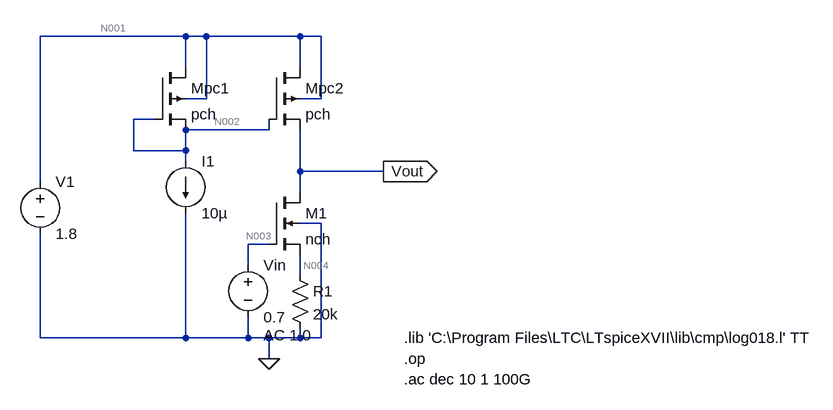
[diagram p0: schematic Exc2.asc]
Exc2.asc, the LTspice schematic file:
Version 4
SHEET 1 1112 680
WIRE 64 -32 -160 -32
WIRE 96 -32 64 -32
WIRE 240 -32 96 -32
WIRE 272 -32 240 -32
WIRE 64 16 64 -32
WIRE 240 16 240 -32
WIRE 96 64 96 -32
WIRE 96 64 64 64
WIRE 272 64 272 -32
WIRE 272 64 240 64
WIRE 16 96 -16 96
WIRE 192 112 192 96
WIRE 192 112 64 112
WIRE -16 144 -16 96
WIRE 64 144 64 112
WIRE 64 144 -16 144
WIRE 64 160 64 144
WIRE 240 176 240 112
WIRE 368 176 240 176
WIRE -160 192 -160 -32
WIRE 240 208 240 176
WIRE 272 256 240 256
WIRE 192 288 160 288
WIRE 160 320 160 288
WIRE 240 336 240 304
WIRE -160 432 -160 272
WIRE 64 432 64 240
WIRE 64 432 -160 432
WIRE 160 432 160 400
WIRE 160 432 64 432
WIRE 192 432 160 432
WIRE 240 432 240 416
WIRE 240 432 192 432
WIRE 272 432 272 256
WIRE 272 432 240 432
WIRE 192 464 192 432
FLAG 192 464 0
FLAG 368 176 Vout
IOPIN 368 176 Out
SYMBOL nmos4 192 208 R0
SYMATTR InstName M1
SYMATTR Value nch
SYMATTR Value2 l=0.18u w=1u m=8
SYMBOL pmos4 192 16 R0
SYMATTR InstName Mpc2
SYMATTR Value pch
SYMATTR Value2 l=1u w=1u
SYMBOL pmos4 16 16 R0
SYMATTR InstName Mpc1
SYMATTR Value pch
SYMATTR Value2 l=1u w=1u
SYMBOL current 64 160 R0
WINDOW 123 0 0 Left 0
WINDOW 39 0 0 Left 0
SYMATTR InstName I1
SYMATTR Value 10µ
SYMBOL voltage 160 304 R0
WINDOW 123 24 124 Left 2
WINDOW 39 0 0 Left 0
SYMATTR Value2 AC 1 0
SYMATTR InstName Vin
SYMATTR Value 0.7
SYMBOL voltage -160 176 R0
WINDOW 123 0 0 Left 0
WINDOW 39 0 0 Left 0
SYMATTR InstName V1
SYMATTR Value 1.8
SYMBOL res 224 320 R0
SYMATTR InstName R1
SYMATTR Value 20k
TEXT 400 464 Left 2 !.op
TEXT 400 432 Left 2 !.lib 'C:\\Program Files\\LTC\\LTspiceXVII\\lib\\cmp\\log018.l' TT
TEXT 400 496 Left 2 !.ac dec 10 1 100G

The netlist it stands for:
* Exc2.asc
M1 Vout N003 N004 0 nch l=0.18u w=1u m=8
Mpc2 N001 N002 Vout N001 pch l=1u w=1u
Mpc1 N001 N002 N002 N001 pch l=1u w=1u
I1 N002 0 10µ
Vin N003 0 0.7 AC 1 0
V1 N001 0 1.8
R1 N004 0 20k
.model NMOS NMOS
.model PMOS PMOS
.lib standard.mos
.op
.lib 'C:\Program Files\LTC\LTspiceXVII\lib\cmp\log018.l' TT
.ac dec 10 1 100G
.backanno
.end

* Results of the author's LTspice run, read from the files saved beside the schematic
* Operating Point, zero values left out:
*   V(vout) = 985.1 mV
*   V(n003) = 700 mV
*   V(n004) = 198 mV
*   V(n001) = 1.8 V
*   V(n002) = 697.2 mV
*   Id(Mpc1) = 10 µA
*   Ib(Mpc1) = 1.113 pA
*   Is(Mpc1) = -10 µA
*   Id(Mpc2) = 9.899 µA
*   Is(Mpc2) = -9.899 µA
*   Id(M1) = 9.899 µA
*   Ib(M1) = -10.1 pA
*   Is(M1) = -9.899 µA
*   I(I1) = 10 µA
*   I(R1) = 9.899 µA
*   I(V1) = -19.9 µA
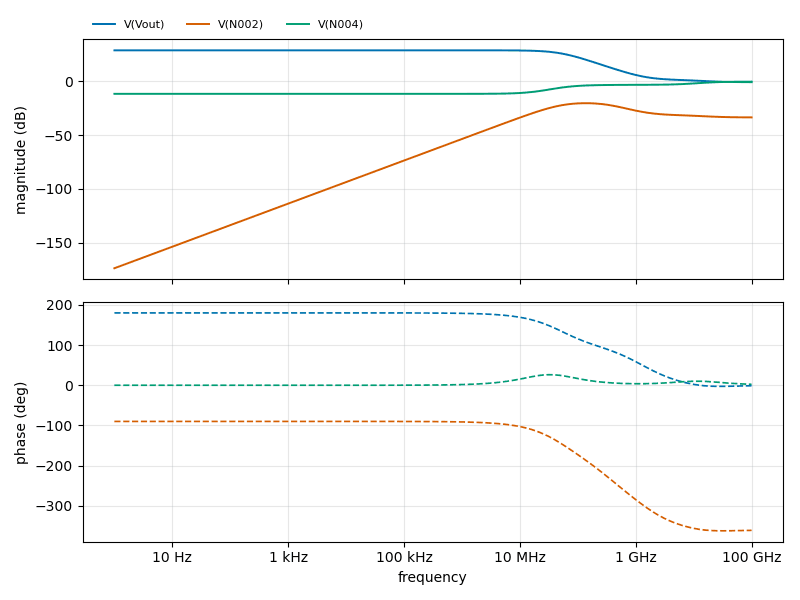
[diagram p1: AC Analysis of Exc2.asc, plotted from the saved traces]
* AC Analysis, 1 run:
*   V(Vout): 28.61 dB at 1 Hz, -0.93 dB at 100 GHz, peak 28.61 dB at 1 Hz, 3 dB below the peak at 53.04 MHz
*   V(N002): -173.70 dB at 1 Hz, -33.64 dB at 100 GHz, peak -20.46 dB at 125.9 MHz, 3 dB below the peak at 41.72 MHz and 467.5 MHz
*   V(N004): -11.77 dB at 1 Hz, -0.45 dB at 100 GHz, peak -0.45 dB at 100 GHz, 3 dB below the peak at 620.4 MHz
* From the log:
*   Semiconductor Device Operating Points:
*                           --- BSIM3 MOSFETS ---
*   Name:       mpc1        mpc2         m1
*   Model:      pch.8       pch.8       nch.9
*   Id:        1.00e-05    9.90e-06    9.90e-06
*   Vgs:       0.00e+00   -2.88e-01    5.02e-01
*   Vds:       1.10e+00    8.15e-01    7.87e-01
*   Vbs:       1.10e+00    8.15e-01   -1.98e-01
*   Vth:      -4.49e-01   -4.49e-01    5.80e-01
*   Vdsat:    -5.32e-01   -5.32e-01    5.17e-02
*   Gm:        2.69e-05    2.65e-05    2.06e-04
*   Gds:       2.74e-07    4.79e-07    4.63e-06
*   Gmb        9.38e-06    9.26e-06    5.33e-05
*   Cbd:       0.00e+00    0.00e+00    0.00e+00
*   Cbs:       0.00e+00    0.00e+00    0.00e+00
*   Cgsov:     3.18e-16    3.18e-16    2.87e-15
*   Cgdov:     3.18e-16    3.18e-16    2.87e-15
*   Cgbov:     2.73e-16    2.73e-16    2.55e-16
*   dQgdVgb:   7.31e-15    7.32e-15    9.41e-15
*   dQgdVdb:  -3.21e-16   -3.31e-16   -2.87e-15
*   dQgdVsb:  -6.55e-15   -6.55e-15   -3.52e-15
*   dQddVgb:  -3.29e-16   -3.51e-16   -2.87e-15
*   dQddVdb:   3.27e-16    3.52e-16    2.87e-15
*   dQddVsb:   5.57e-18    1.03e-17    6.71e-19
*   dQbdVgb:  -1.30e-15   -1.29e-15   -3.04e-15
*   dQbdVdb:  -1.98e-18   -8.15e-18    4.81e-19
*   dQbdVsb:  -8.61e-16   -8.62e-16   -1.51e-16